# EasyEDA schematic oLoRa-part-Geiger.json
TITLE: oLoRa-part-Geiger; REV: 1.0; Date: 2019-08-19; Sheet: 1/1; Drawn By: 한유석; Company: RMTEC
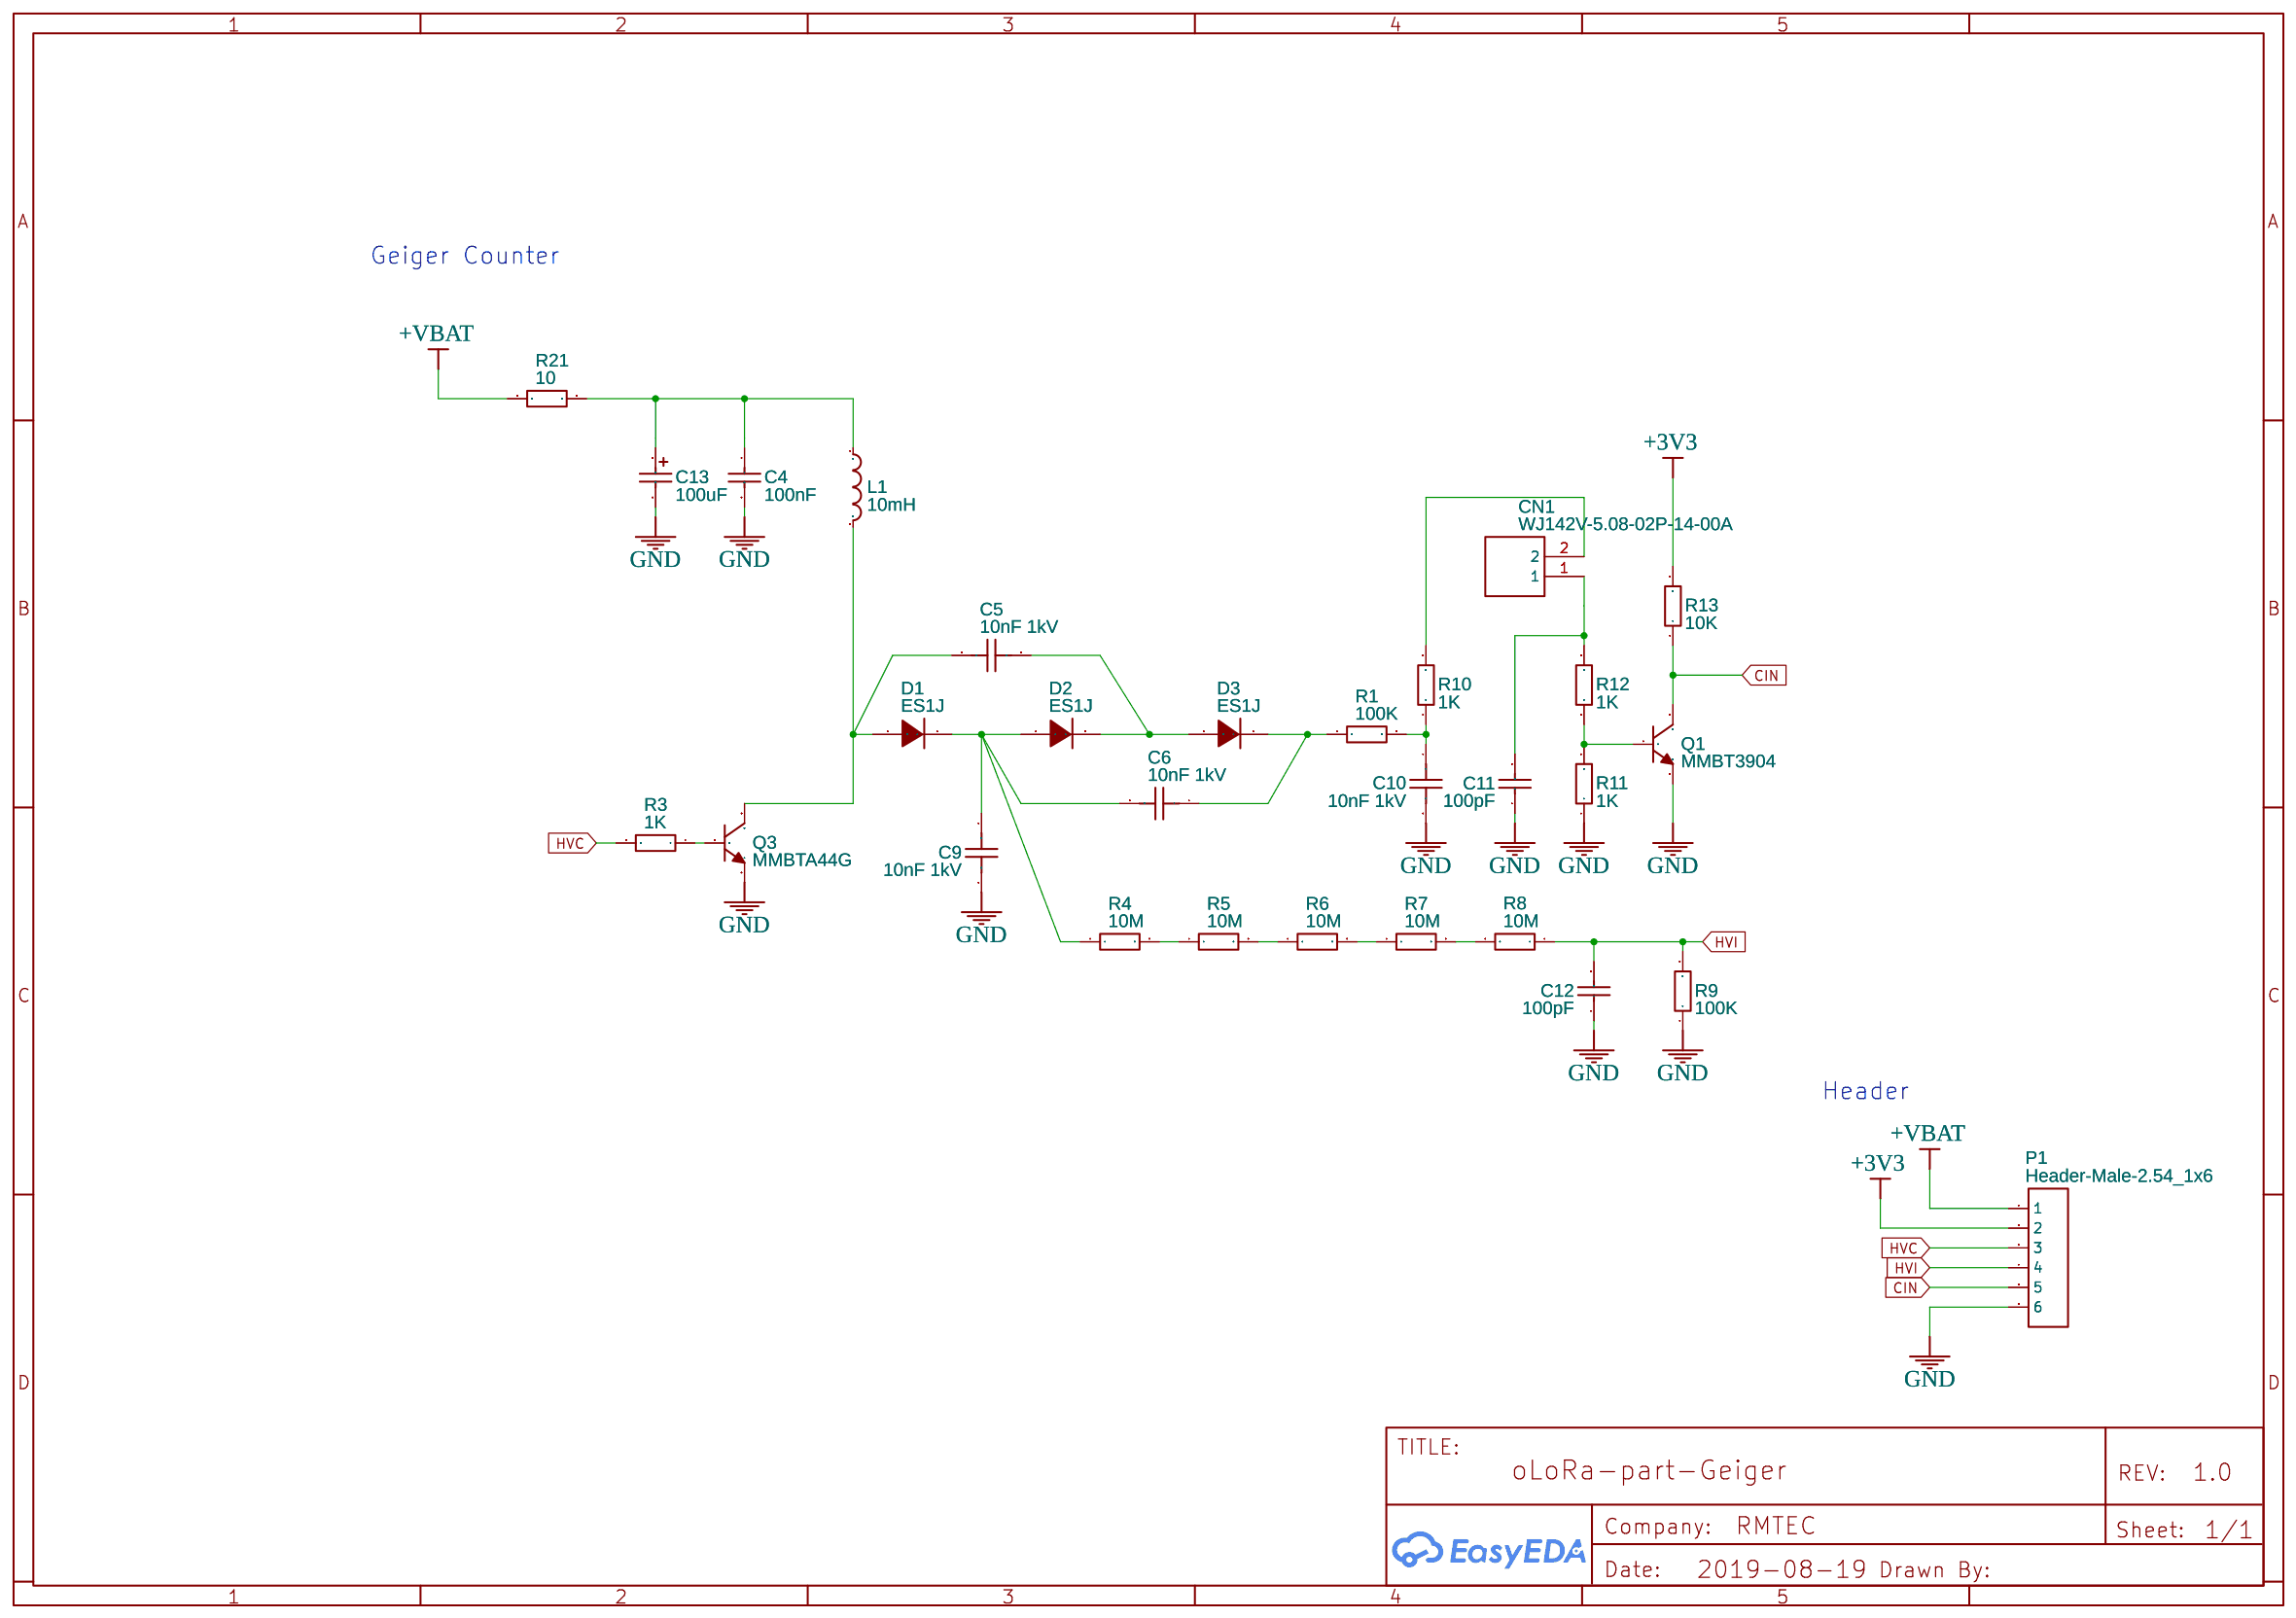
[diagram p0: schematic sheet]

## Parts
C4  100nF  [0603]
C5  10nF 1kV  [1206]
C6  10nF 1kV  [1206]
C9  10nF 1kV  [1206]
C10  10nF 1kV  [1206]
C11  100pF  [0603]
C12  100pF  [0603]
C13  100uF  [CASE-B_3528]
CN1  WJ142V-5.08-02P-14-00A  [WJ142V-5.08-2P]
D1  ES1J  [SMA(DO-214AC)]
D2  ES1J  [SMA(DO-214AC)]
D3  ES1J  [SMA(DO-214AC)]
L1  10mH  [IND-505040]
P1  Header-Male-2.54_1x6  [HDR-6X1/2.54]
Q1  MMBT3904  [SOT-23(SOT-23-3)]
Q3  MMBTA44G  [SOT-23(SOT-23-3)]
R1  100K  [0603]
R3  1K  [0603]
R4  10M  [0603]
R5  10M  [0603]
R6  10M  [0603]
R7  10M  [0603]
R8  10M  [0603]
R9  100K  [0603]
R10  1K  [0603]
R11  1K  [0603]
R12  1K  [0603]
R13  10K  [0603]
R21  10  [0805]

## Library data of the parts
C4 = 0603B104K500NT: Supplier: LCSC; Manufacturer: FH; Supplier Part: C30926
C5 C6 C9 C10 = 1206B103K102CT: Supplier: LCSC; Supplier Part: C303948; Manufacturer: Huaxin S&T; Contributor: LCSC
C11 C12 = 0603CG101J500NT: Supplier: LCSC; Manufacturer: FH; Supplier Part: C1635; LCSC Assembly: Yes; SMT Type: Extend
C13 = TAJB107M010RNJ: Supplier: LCSC; Manufacturer: AVX; Supplier Part: C7196; LCSC Assembly: Yes; SMT Type: Extend
CN1 = -: Supplier: LCSC; Supplier Part: C153288; Manufacturer: Ningbo Kangnex Elec; Contributor: LCSC
D1-D3 = -: Supplier: LCSC; Supplier Part: C232830; Manufacturer: ON Semicon; Contributor: LCSC
L1 = FNR5040S103MT: Supplier: LCSC; Manufacturer: cjiang; Contributor: LCSC; Supplier Part: C167995
P1 = -: Supplier: LCSC; Manufacturer: BOOMELE; Supplier Part: C37208
Q1 = -: Supplier: LCSC; Manufacturer: SK; Supplier Part: C111113; LCSC Assembly: Yes; SMT Type: Extend
Q3 = -: Supplier: LCSC; Manufacturer: UTC; Manufacturer Part: MMBTA44G-AE3-R; Supplier Part: C84882; LCSC Assembly: Yes; SMT Type: Extend
R1 R9 = RC0603FR-07100KL: Supplier: LCSC; Supplier Part: C14675; Manufacturer: YAGEO; Contributor: LCSC
R3 R10-R12 = RC0603FR-071KL: Supplier: LCSC; Manufacturer: YAGEO; Supplier Part: C22548
R4-R8 = RTT031005FTP: Supplier: LCSC; Manufacturer: RALEC; Supplier Part: C103202
R13 = 0603WAF1002T5E: Supplier: LCSC; Manufacturer: UniOhm; LCSC Assembly: Yes; Supplier Part: C25804; SMT Type: Basic
R21 = RC0805FR-0710RL: Supplier: LCSC; Manufacturer: YAGEO; Supplier Part: C96347

## Nets
+3V3: P1.2 R13.2
+VBAT: P1.1 R21.1
GND: C4.2 C9.2 C10.2 C11.1 C12.1 C13.2 P1.6 Q1.2 Q3.2(E) R9.1 R11.1
CIN: P1.5 Q1.3 R13.1
HVC: P1.3 R3.2
HVI: C12.2 P1.4 R8.1 R9.2
Net-(C4-1): C4.1 C13.1 L1.1 R21.2
Net-(C5-1): C5.1 D2.2(K) D3.1(A)
Net-(C5-2): C5.2 D1.1(A) L1.2 Q3.3(C)
Net-(C6-1): C6.1 D3.2(K) R1.1
Net-(C6-2): C6.2 C9.1 D1.2(K) D2.1(A) R4.1
Net-(C10-1): C10.1 R1.2 R10.1
Net-(C11-2): C11.2 CN1.1 R12.2
Net-(CN1-2): CN1.2 R10.2
Net-(Q1-1): Q1.1 R11.2 R12.1
Net-(Q3-1): Q3.1(B) R3.1
Net-(R4-2): R4.2 R5.1
Net-(R5-2): R5.2 R6.1
Net-(R6-2): R6.2 R7.1
Net-(R7-2): R7.2 R8.2

## Notes on the sheet
- Geiger Counter
- Header
